# EAGLE design ML8511_breakout (EAGLE 7.2.0)
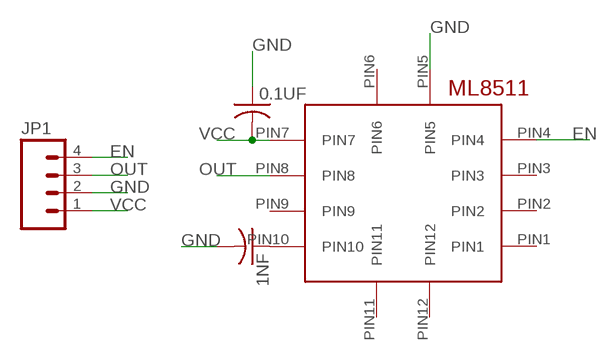
[diagram p0: schematic, sheet 1]

## Parts
0.1UF  C-USC0603  [C0603]
1NF  C-USC0603  [C0603]
JP1  M04PTH  [1X04]
U$1  ML8511  [ML8511]

## Nets
EN: JP1.4 U$1.PIN4
GND: 0.1UF.1 1NF.2 JP1.2 U$1.PIN5
OUT: JP1.3 U$1.PIN8
TR: 1NF.1 U$1.PIN10
VCC: 0.1UF.2 JP1.1 U$1.PIN7
Unconnected: U$1.PIN1 U$1.PIN2 U$1.PIN3 U$1.PIN6 U$1.PIN9 U$1.PIN11 U$1.PIN12

## Library data of the parts
0.1UF 1NF = rcl:C-US: CAPACITOR, American symbol
JP1 = SparkFun-Connectors:M04: Header 4 Standard 4-pin 0.1" header. Use with straight break away headers (SKU : PRT-00116), right angle break away headers (PRT-00553), swiss pins (PRT-00743), machine pins (PRT-00117), and female headers (PRT-00115). Molex polarized connector foot print use with SKU : PRT-08231 with associated crimp pins and housings. 1MM SMD Version SKU: PRT-10208
U$1 = awqua_eagle_library:ML8511

## Board
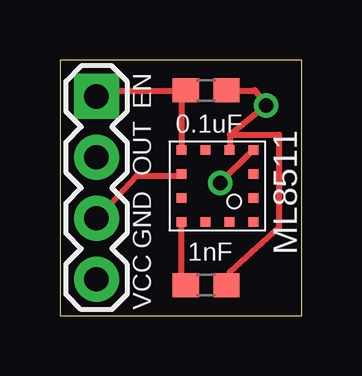
[diagram p1: board, top side]
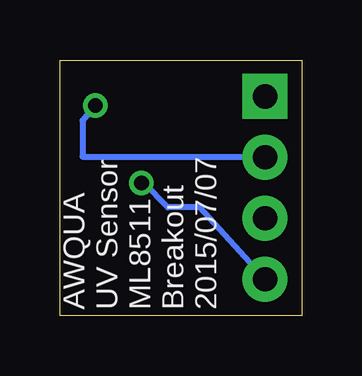
[diagram p2: board, bottom side, seen from below]

Size 10.08 x 10.66 mm. Coordinates in mm from the lower left corner, seen from the top.
Outline: 0,0 10.08,0 10.08,10.66 0,10.66 0,0
Copper layers (1*16): Top 0.035mm / dielectric 1.5mm / Bottom 0.035mm
Design rules "default": minimum track width 10mil, minimum drill 24mil, track to track 8mil, track to pad 8mil, pad to pad 8mil, via to via 8mil, smd to smd 8mil, copper to edge 40mil, drill to drill 8mil, minimum pad ring 10mil, minimum via ring 8mil, stop-mask expansion 4mil, vias tented up to drill 0mil, thermal gap 10mil

### Footprints (pad centres in the part's own frame; a part is rotated, then mirrored left to right if it is on the bottom)
C0603 = smd 1.1 x 1: 1 -0.85,0; 2 0.85,0
1X04 = drill 1.016 pad 1.88 square: 1 0,0 | drill 1.016 pad 1.88: 2 2.54,0; 3 5.08,0; 4 7.62,0
ML8511 = smd 0.4 x 0.4: PIN1 3.5,0.35; PIN2 3.5,1.35; PIN3 3.5,2.35; PIN4 3.5,3.35; PIN5 2.5,3.35; PIN6 1.5,3.35; PIN7 0.5,3.35; PIN8 0.5,2.35; PIN9 0.5,1.35; PIN10 0.5,0.35; PIN11 1.5,0.35; PIN12 2.5,0.35

### Placement (x,y rotation side)
0.1UF  6.1,9.4 180 top
1NF  6.1,1.27 0 top
JP1  1.52,9.14 270 top
U$1  4.57,3.56 0 top

### Tracks (layer width: path | path; a pad name or v marks a point on that pad's centre or on a via)
EN  (via drill 0.61)
  Top 0.254: v6.68,5.54 8,6.86 U$1.PIN4
  Bottom 0.254: v6.68,5.54 6.6,5.54 5.59,4.52 4.27,4.52 JP1.4
GND  (via drill 0.61)
  Top 0.254: 7.09,7.54 v8.61,8.76 8.13,9.4 8.13,9.37 7.09,9.37 0.1UF.1 | 7.09,7.54 7.09,7.09 U$1.PIN5 | 7.09,7.54 9.14,7.54 9.14,3.68 7.09,1.83 7.09,1.37 1NF.2
  Bottom 0.254: v8.61,8.76 9.14,8.13 9.14,6.63 1.6,6.63 JP1.2
OUT
  Top 0.254: U$1.PIN8 5.03,5.84 3.2,5.84 1.6,4.12 JP1.3
TR
  Top 0.254: U$1.PIN10 5.08,3.89 5.08,1.37 1NF.1
VCC
  Top 0.254: 5.08,9.37 5.26,9.37 0.1UF.2 5.03,9.37 | 5.08,9.37 U$1.PIN7 | 5.08,9.37 1.83,9.37 1.6,9.14 JP1.1

### Text on the board
tNames: EN | 0.1uF | OUT | GND | ML8511 | 1nF | VCC
bNames: AWQUA / UV Sensor / ML8511 / Breakout / 2015/07/07